# EAGLE design MINI_SAM_2017-01-015 (EAGLE 7.6.0)
BUILD: 2017/01; DESIGNER: BENJAMIN SHOCKLEY; REV: 015
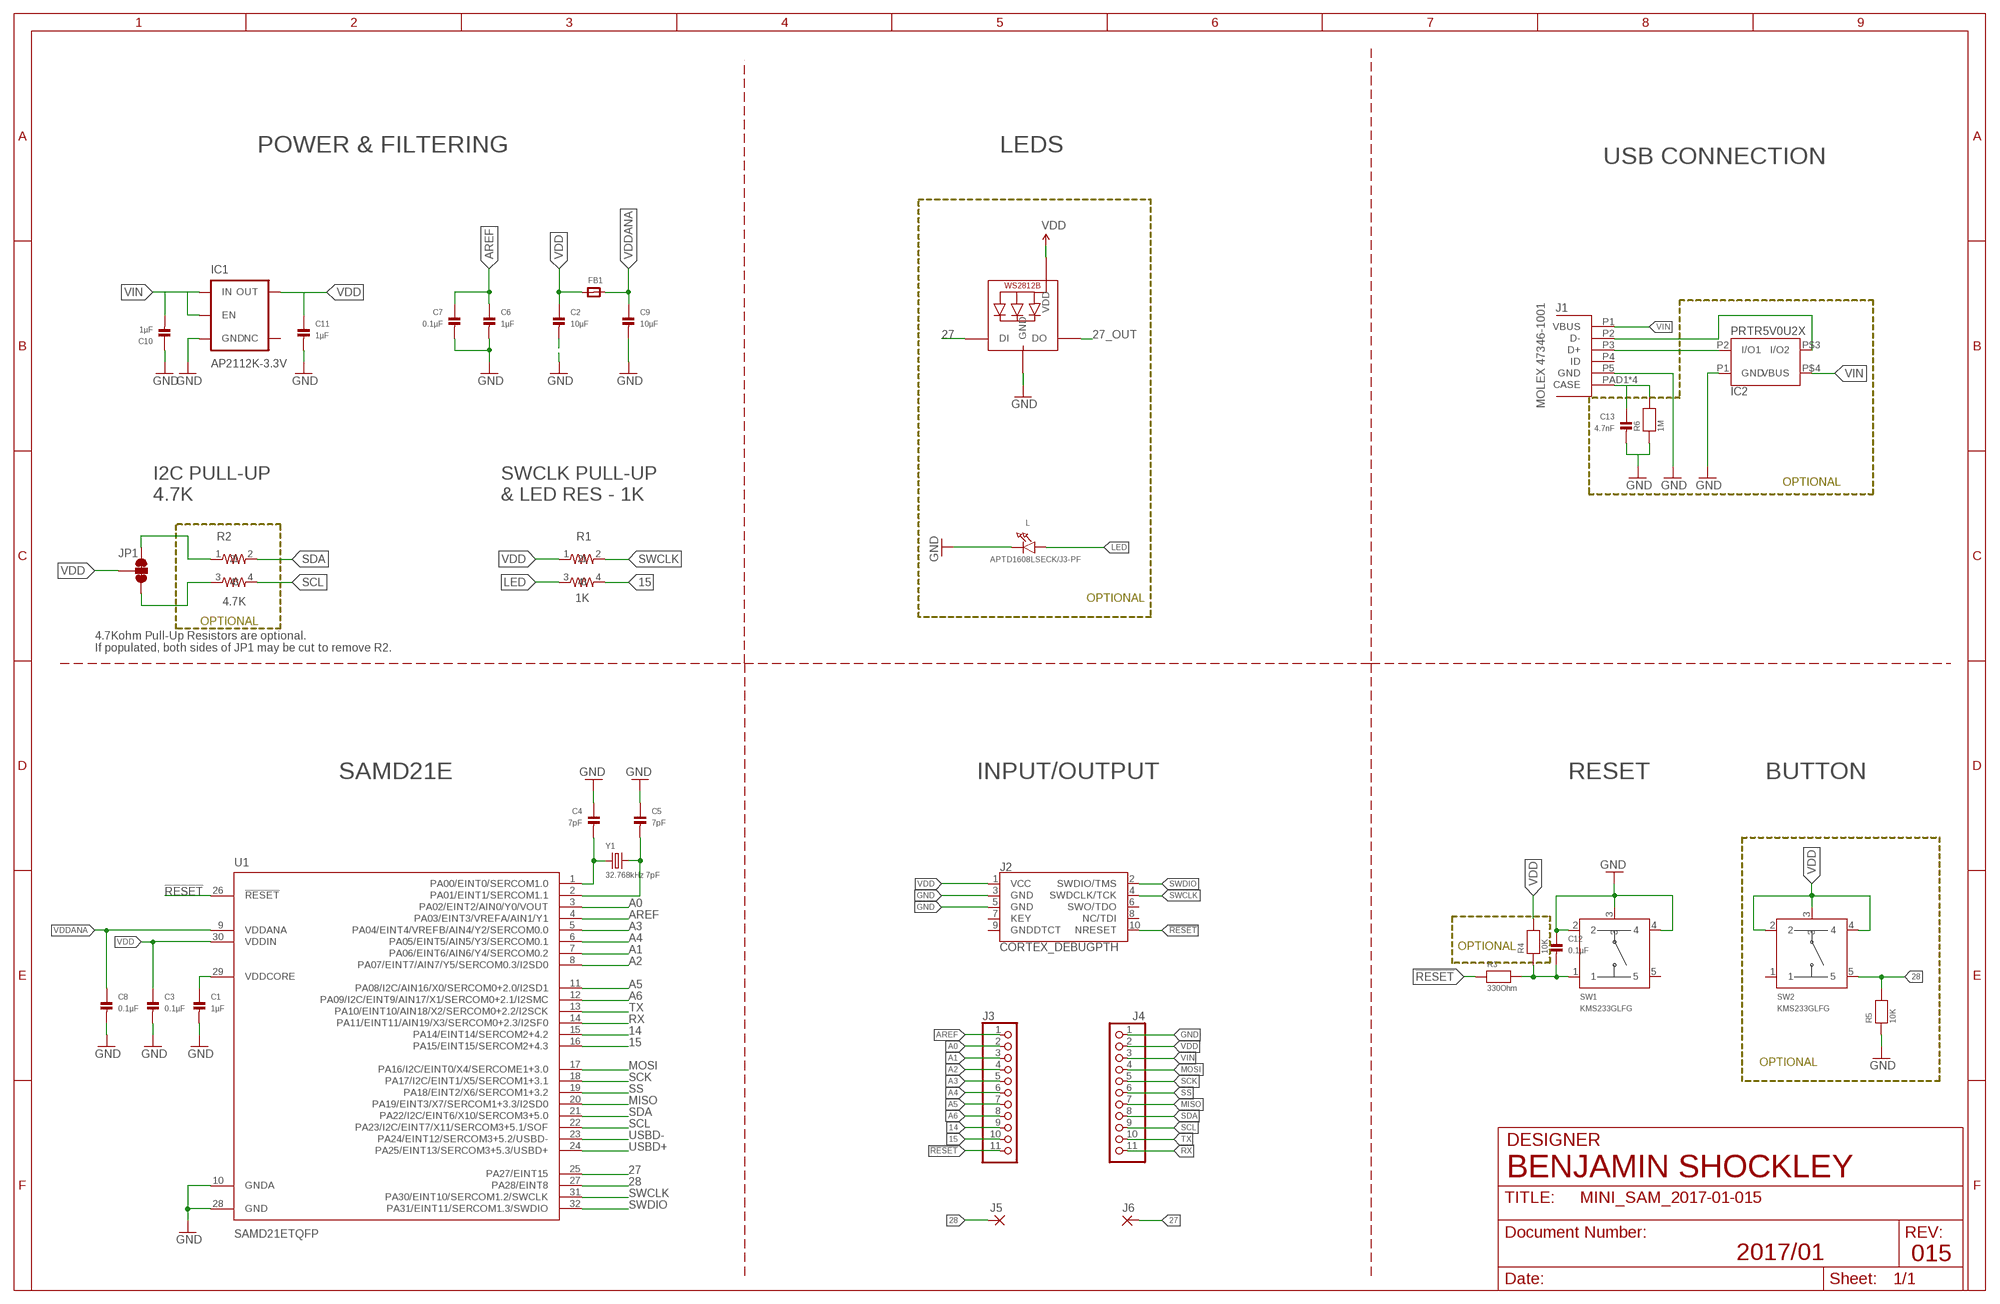
[diagram p0: schematic, sheet 1]

## Parts
C1  1µF  CAP_CERAMIC_0805MP  [_0805MP]
C2  10µF  CAP_CERAMIC_0805MP  [_0805MP]
C3  0.1µF  CAP_CERAMIC_0805MP  [_0805MP]
C4  7pF  CAP_CERAMIC_0805MP  [_0805MP]
C5  7pF  CAP_CERAMIC_0805MP  [_0805MP]
C6  1µF  CAP_CERAMIC_0805MP  [_0805MP]
C7  0.1µF  CAP_CERAMIC_0805MP  [_0805MP]
C8  0.1µF  CAP_CERAMIC_0805MP  [_0805MP]
C9  10µF  CAP_CERAMIC_0805MP  [_0805MP]
C10  1µF  CAP_CERAMIC_0805MP  [_0805MP]
C11  1µF  CAP_CERAMIC_0805MP  [_0805MP]
C12  0.1µF  CAP_CERAMIC_0805MP  [_0805MP]
C13  4.7nF  CAP_CERAMIC_0805MP  [_0805MP]
FB1  FERRITE_0805MP  [_0805MP]
IC1  AP2112K-3.3V  V_REG_AP2112K-3.3V  [SOT23-5]
IC2  PRTR5V0U2X  [SOT143B_REFLOW]
J1  MOLEX_47346-100147346  [MOLEX_47346-1001]
J2  CORTEX_DEBUGPTH  [2X5-PTH-1.27MM]
J3  PINHD-1X111X11_SMT  [1X11_SMT]
J4  PINHD-1X111X11_SMT  [1X11_SMT]
J5  FR11_PAD2MMX1MM  [SMD2MMX1MM]
J6  FR11_PAD2MMX1MM  [SMD2MMX1MM]
JP1  JUMPER-SMT_3_2-NC_TRACE_NO-SILK  [SMT-JUMPER_3_2-NC_TRACE_NO-SILK]
L  APTD1608LSECK/J3-PF  LED0603_NOOUTLINE  [CHIPLED_0603_NOOUTLINE]
R1  1K  RESISTOR_ARRAY_2  [RESISTOR_ARRAY_0606]
R2  4.7K  RESISTOR_ARRAY_2  [RESISTOR_ARRAY_0606]
R3  330Ohm  RESISTOR_0805MP  [_0805MP]
R4  10K  RESISTOR_0805MP  [_0805MP]
R5  10K  RESISTOR_0805MP  [_0805MP]
R6  1M  RESISTOR_0805MP  [_0805MP]
STATUS  WS2812B3535  [LED3535]
SW1  KMS233GLFG  KMS_SWITCHKMS  [KMS_SWITCH]
SW2  KMS233GLFG  KMS_SWITCHKMS  [KMS_SWITCH]
U1  SAMD21ETQFP  [TQFP32-08]
Y1  32.768kHz 7pF  CRYSTAL0805PACKAGE  [_0805MP]

## Nets
14: J3.9 U1.15(PA14/EINT14/SERCOM2+4.2)
15: J3.10 R1.4 U1.16(PA15/EINT15/SERCOM2+4.3)
27: J6.P$1(P) STATUS.1(DI) U1.25(PA27/EINT15)
27_OUT: STATUS.3(DO)
28: J5.P$1(P) R5.2 SW2.5 U1.27(PA28/EINT8)
!RESET: J2.10(NRESET) J3.11 R3.1 U1.26(!RESET)
A0: J3.2 U1.3(PA02/EINT2/AIN0/Y0/VOUT)
A1: J3.3 U1.7(PA06/EINT6/AIN6/Y4/SERCOM0.2)
A2: J3.4 U1.8(PA07/EINT7/AIN7/Y5/SERCOM0.3/I2SD0)
A3: J3.5 U1.5(PA04/EINT4/VREFB/AIN4/Y2/SERCOM0.0)
A4: J3.6 U1.6(PA05/EINT5/AIN5/Y3/SERCOM0.1)
A5: J3.7 U1.11(PA08/I2C/AIN16/X0/SERCOM0+2.0/I2SD1)
A6: J3.8 U1.12(PA09/I2C/EINT9/AIN17/X1/SERCOM0+2.1/I2SMC)
AREF: C6.1 C7.1 J3.1 U1.4(PA03/EINT3/VREFA/AIN1/Y1)
GND: C1.2 C2.2 C3.2 C4.1 C5.1 C6.2 C7.2 C8.2 C9.2 C10.1 C11.2 C12.1 C13.2 IC1.2(GND) IC2.P1(GND) J1.P5(GND) J2.3(GND) J2.5(GND) J4.1 L.C R5.1 R6.1 STATUS.4(GND) SW1.2 SW1.3 SW1.4 U1.10(GNDA) U1.28(GND)
LED: L.A R1.3
MISO: J4.7 U1.20(PA19/EINT3/X7/SERCOM1+3.3/I2SD0)
MOSI: J4.4 U1.17(PA16/I2C/EINT0/X4/SERCOME1+3.0)
N$1: C4.2 U1.1(PA00/EINT0/SERCOM1.0) Y1.1
N$2: C13.1 J1.PAD1(CASE) J1.PAD2(CASE) J1.PAD3(CASE) J1.PAD4(CASE) R6.2
N$3: JP1.1 R2.1
N$4: C12.2 R3.2 R4.1 SW1.1
N$5: C5.2 U1.2(PA01/EINT1/SERCOM1.1) Y1.2
N$6: JP1.3 R2.3
N$9: C1.1 U1.29(VDDCORE)
RX: J4.11 U1.14(PA11/EINT11/AIN19/X3/SERCOM0+2.3/I2SF0)
SCK: J4.5 U1.18(PA17/I2C/EINT1/X5/SERCOM1+3.1)
SCL: J4.9 R2.4 U1.22(PA23/I2C/EINT7/X11/SERCOM3+5.1/SOF)
SDA: J4.8 R2.2 U1.21(PA22/I2C/EINT6/X10/SERCOM3+5.0)
SS: J4.6 U1.19(PA18/EINT2/X6/SERCOM1+3.2)
SWCLK: J2.4(SWDCLK/TCK) R1.2 U1.31(PA30/EINT10/SERCOM1.2/SWCLK)
SWDIO: J2.2(SWDIO/TMS) U1.32(PA31/EINT11/SERCOM1.3/SWDIO)
TX: J4.10 U1.13(PA10/EINT10/AIN18/X2/SERCOM0+2.2/I2SCK)
USBD+ [USB_DATA]: IC2.P2(I/O1) J1.P3(D+) U1.24(PA25/EINT13/SERCOM3+5.3/USBD+)
USBD- [USB_DATA]: IC2.P$3(I/O2) J1.P2(D-) U1.23(PA24/EINT12/SERCOM3+5.2/USBD-)
VDD: C2.1 C3.1 C11.1 FB1.1 IC1.5(OUT) J2.1(VCC) J4.2 JP1.2 R1.1 R4.2 STATUS.2(VDD) SW2.2 SW2.3 SW2.4 U1.30(VDDIN)
VDDANA: C8.1 C9.1 FB1.2 U1.9(VDDANA)
VIN: C10.2 IC1.1(IN) IC1.3(EN) IC2.P$4(VBUS) J1.P1(VBUS) J4.3
Unconnected: IC1.4(NC) J1.P4(ID) J2.6(SWO/TDO) J2.7(KEY) J2.8(NC/TDI) J2.9(GNDDTCT) SW1.5 SW2.1

## Notes on the sheet
- POWER & FILTERING | LEDS
- USB CONNECTION
- MOLEX 47346-1001
- OPTIONAL
- I2C PULL-UP
  4.7K
- SWCLK PULL-UP
  & LED RES - 1K
- OPTIONAL
- OPTIONAL
- 4.7Kohm Pull-Up Resistors are optional.
  If populated, both sides of JP1 may be cut to remove R2.
- SAMD21E | INPUT/OUTPUT | RESET | BUTTON
- OPTIONAL
- OPTIONAL
- DESIGNER

## Library data of the parts
C1-C13 = microbuilder:CAP_CERAMIC: Ceramic Capacitors 0402 - 0402 Surface Mount Capacitors 16pF 50V 5% [Digikey: 445-4899-2-ND] 18pF 50V 5% [Digikey: 490-1281-2-ND] 22pF 50V 5% [Digikey: 490-1283-2-ND] 68pF 50V 5% [Digikey: 490-1289-2-ND] 0.1uF 10V 10% [Digikey: 490-1318-2-ND] 1.0uF 6.3V 10% [Digikey: 490-1320-2-ND] 0603 - 0603 Surface Mount Capacitors 16 pF 50V 5% [Digikey: 445-5051-2-ND] 22 pF 50V [Digikey: PCC220ACVTR-ND] 33 pF 50V 5% [Digikey: 490-1415-1-ND] 56pF 50V 5% [Digikey: 490-1421-1-ND] 220pF 50V 5% [Digikey: 445-1285-1-ND] 680 pF 50V 2200 pF 50V 5% C0G [Digikey: 445-1297-1-ND] 5600 pF 100V 5% X7R [Digikey: 478-3711-1-ND] 0.1 µF 25V 10% [Digikey: PCC2277TR-ND] 0.22 µF 16V 10% X7R [Digikey: 445-1318-1-ND] 1.0 µF 25V 10% [Digikey: 445-5146-2-ND] 0603 - RF Specific 3pF 250V +/-0.1pF RF [Digikey: 712-1347-1-ND] 18 pF 250V 5% [Digikey: 478-3505-1-ND or 712-1322-1-ND] 56 pF 250V 5% C0G RF [Digikey: 490-4867-1-ND] 68 pF 250V RF [Digikey: 490-4868-1-ND] 0805 - 0805 Surface Mount Capacitors 220 pF 250V 2% RF Ceramic Capacitor [Digikey: 712-1398-1-ND] 1000 pF 50V 2% NP0 Ceramic Capacitor [Digikey: 478-3760-1-ND] 0.1 µF 25V 10% Ceramic Capacitor [Digikey: PCC1828TR-ND] 1.0 µF 16V 10% Ceramic Capacitor[Digikey: 490-1691-2-ND] 10.0 µF 10V 10% Ceramic Capacitor[Digikey: 709-1228-1-ND] 10.0 uF 16V 10% Ceramic Capacitor [Digikey: 478-5165-2-ND] 47 uF 6.3V 20% Ceramic Capacitor [Digikey: 587-1779-1-ND or 399-5506-1-ND] 1206 - 1206 Surface Mount Capacitors 47uF 10V 20% Ceramic Capacitor [Digikey: 490-5528-1-ND or 399-5508-1-ND or 445-6010-1-ND] 100uF 6.3V -20%, +80% Y5V Ceramic Capacitor (Digikey: 490-4512-1-ND, Mouser: 81-GRM31CF50J107ZE1L)
FB1 = microbuilder:FERRITE: Ferrite Bead 0603 MMZ1608B121C - 120 Ohm @ 100MHz, 600mA, 0.15 Ohm DC Resistance - Digikey: 445-2164-1-ND BK1608HW121-T - 120 Ohm, 600mA Ferrite Chip - Digikey: 587-1876-2-ND 0805 HZ0805B272R-10 - 2.7K Ohm @ 100MHz, 200mA, 0.8 Ohm DC Resistance - Digikey: 240-2504-1-ND (see also Murata BLM21BD272SN1L) MMZ2012Y152B - 1.5K Ohm @ 100MHz, 500mA, 0.4 Ohm DC Resistance - Digikey: 445-1560-1-ND - Mainly for high frequency (80-400MHz) MMZ2012R102A - 1K Ohm @ 100MHz, 500mA, 0.3 Ohm DC Resistance - Digikey: 445-1555-2-ND - More general purpose (10-200MHz)
IC1 = SparkFun-PowerIC:V_REG_AP2112: AP2112 - 600mA CMOS LDO Regulator w/ Enable The AP2112 is CMOS process low dropout linear regulator with enable function, the regulator delivers a guaranteed 600mA (min.) continuous load current. Features Output Voltage Accuracy: ±1.5% Output Current: 600mA (Min.) Foldback Short Current Protection: 50mA Enable Function to Turn ON/OFF VOUT Low Dropout Voltage (3.3V): 250mV (Typ.) @IOUT=600mA Excellent Load Regulation: 0.2%/A (Typ.) Excellent Line Regulation: 0.02%/V (Typ.) Low Quiescent Current: 55μA (Typ.) Low Standby Current: 0.01μA (Typ.) Low Output Noise: 50μVRMS PSRR: 100Hz -65dB, 1kHz -65dB OTSD Protection Stable with 1.0μF Flexible Cap: Ceramic, Tantalum and Aluminum Electrolytic Operation Temperature Range: -40°C to 85°C ESD: MM 400V, HBM 4000V; PROD_ID: VREG-12457; VALUE: 3.3V
IC2 = Shockley_Custom:PRTR5V0U2X
J1 = Shockley_Custom:MOLEX_47346-1001
J2 = SparkFun-Connectors:CORTEX_DEBUG: Cortex Debug Connector Datasheet <http://infocenter.arm.com/help/topic/com.arm.doc.faqs/attached/13634/cortex_debug_connectors.pdf>
J3 J4 = pinhead+:PINHD-1X11: PIN HEADER
J5 J6 = Shockley_Custom:FR11_PAD
JP1 = SparkFun-Jumpers:JUMPER-SMT_3_2-NC_TRACE: Normally closed trace jumper (2 of 2 connections) This jumper has a trace between all three pads so they are normally closed (NC). Use a razor knife to open the connection(s). For best results follow the IPC guidelines for cutting traces: Cutout at least 0.063 mm (0.005 in). Remove all loose material to clean up the cut area. Seal the cut with an approved epoxy. Reapply solder to reclose the connection(s).
L = microbuilder:LED: LED 0603 - 0603 Surface Mount Package 2mA: Green LED - Low Power (3.9mcd, 2ma, 1.7Vf) - Digikey: 475-2709-2-ND Orange LED - Low Power (9.8mcd, 2ma, 1.8Vf) - Digikey: 475-1194-2-ND Red LED - Low Power (5mcd, 2ma, 1.8Vf) - Digikey: 475-1195-2-ND Yellow LED - Low Power (7mcd, 2ma, 1.8Vf) - Digikey: 475-1196-2-ND 5mA: Blue LED - Low Power (17mcd, 5ma, 2.9Vf) - Digikey: LNJ937W8CRACT-ND 0805 - 0805 Surface Mount Package 2mA: Red LED (8.8mcd, 2mA, 1.8Vf, Clear) - Low Power [Digikey: 475-2510-1-ND] Green LED (5mcd, 2mA, 1.8Vf, Clear) - Low Power [Digikey: 475-2730-1-ND] Yellow LED (11.3mcd, 2mA, 1.8Vf, Clear) - Low Power [Digikey: 475-2555-1-ND] 20mA: Red LED (104mcd, 20mA, Diffused) - LS R976 [Digikey: 475-1278-6-ND] Red LED (12mcd, 20mA, 2.0Vf, Clear) - APT2012EC [Digikey: 754-1128-1-ND] Green LED (15mcd, 20mA, 2.2Vf, Clear) - APT2012GC [Digikey: 754-1131-1-ND] Orange LED (160mcd, 20mA, 2.1Vf, Clear) - APT2012SECK [Digikey: 754-1130-1-ND] 1206 - 1206 Surface Mount Package Green LED (26mcd, 20mA, Diffused) - LG N971 [Digikey: 475-1407-6-ND] Red LED (15mcd, 20mA, Diffused) - LH N974 [Digikey: 475-1416-6-ND]
R1 R2 = Shockley_Custom:RESISTOR_ARRAY_2
R3-R6 = microbuilder:RESISTOR: Resistors 0402 - 0402 Surface Mount Package 22 Ohm 1% 1/16W [Digikey: 311-22.0LRTR-ND] 33 Ohm 5% 1/16W 1.0K 5% 1/16W 1.5K 5% 1/16W 2.0K 1% 1/16W 10.0K 1% 1/16W [Digikey: 311-10.0KLRTR-ND] 10.0K 5% 1/16W [Digikey: RMCF0402JT10K0TR-ND] 12.1K 1% 1/16W [Digikey: 311-22.0LRTR-ND] 100.0K 5% 1/16W 0603 - 0603 Surface Mount Package 0 Ohm 1/10 Watt 1% Resistor 15 Ohm 1/10 Watt 1% Resistor 33 Ohm 1/10 Watt 1% Resistor 49.9 Ohm 1/10 Watt 1% Resistor 100 Ohm 1/10 Watt 1% Resistor 150 Ohm 1/10 Watt 1% Resistor 240 Ohm 1/10 Watt 1% Resistor 390 Ohm 1/10 Watt 1% Resistor 560 Ohm 1/10 Watt 1% Resistor 680 Ohm 1/10 Watt 1% Resistor 750 Ohm 1/10 Watt 1% Resistor 1.0K Ohm 1/10 Watt 1% Resistor 1.5K Ohm 1/10 Watt 1% Resistor 2.0K Ohm 1/10 Watt 1% Resistor 2.2K Ohm 1/10 Watt 1% Resistor 3.3K Ohm 1/10 Watt 1% Resistor 4.7K Ohm 1/10 Watt 1% Resistor 10.0K Ohm 1/10 Watt 1% Resistor 12.0K Ohm 1/10 Watt 1% Resistor 12.1K Ohm 1/10 Watt 1% Resistor 20.0K Ohm 1/10 Watt 1% Resistor 33.0K Ohm 1/10 Watt 1% Resistor 100.0K Ohm 1/10 Watt 1% Resistor 0805 - 0805 Surface Mount Package 0 Ohm 1/8 Watt 1% Resistor 33 Ohm 1/8 Watt 1% Resistor 100 Ohm 1/8 Watt 1% Resistor 150 Ohm 1/8 Watt 1% Resistor 200 Ohm 1/8 Watt 1% Resistor 240 Ohm 1/8 Watt 1% Resistor 330 Ohm 1/8 Watt 1% Resistor 390 Ohm 1/8 Watt 1% Resistor 470 Ohm 1/8 Watt 1% Resistor 1.0K Ohm 1/8 Watt 1% Resistor 1.5K Ohm 1/8 Watt 1% Resistor 2.0K Ohm 1/8 Watt 1% Resistor 4.7K Ohm 1/8 Watt 1% Resistor 5.1K Ohm 1/8 Watt 1% Resistor 5.6K Ohm 1/8 Watt 1% Resistor 10.0K Ohm 1/8 Watt 1% Resistor 22.0K Ohm 1/8 Watt 1% Resistor 33.0K Ohm 1/8 Watt 1% Resistor 100K Ohm 1/8 Watt 1% Resistor 1206 - 1206 Surface Mount Package 2012 - 2010 Surface Mount Package 0.11 Ohm 1/2 Watt 1% Resistor - Digikey: RHM.11UCT-ND
STATUS = adafruit:WS2812B
SW1 SW2 = Shockley_Custom:KMS_SWITCH
U1 = Shockley_Custom:SAMD21E
Y1 = Shockley_Custom:CRYSTAL: Crystals HC49UP - Surface Mount Crystal 4.0MHz 18pF +/-30ppm Surface Mount Crystal [Digikey: 535-9857-1-ND] 12.0 MHz Surface Mount Crystal [Digikey: 535-9869-6-ND] 25.0 MHz Surface Mount Crystal [Digikey: 535-9078-1-ND] 2.5 x 2.0mm - MEMs SMT Crystal 16.0 MHz 10pF 20ppm 2.5 x 2.0mm Crystal [Digikey -40-85°C: 535-10923-1-ND] 3.2 x 2.5mm - MEMs SMT Crystal 12.0 MHz 8pF 15ppm 3.2 x 2.5mm Crystal [Digikey: -10-70°C: 644-1047-1-ND -40-125°C: 644-1128-1-ND] 16.0 MHz 8pF 15ppm 3.2 x 2.5mm Crystal [Digikey: -10-70°C: 644-1049-1-ND -40-125°C: 644-1129-2-ND] 16.0 MHz 10pF 10ppm 3.2 x 2.5mm Crystal [Digikey: 644-1100-1-ND] 27.12 MHz 18pF 30ppm 3.2 x 2.5mm Crystal [Digikey: 887-1424-1-ND] 27.12MHz 10pF 10ppm 3.2 x 2.5mm Crystal [Digikey: 887-1329-1-ND] 4.9 x 1.8mm - MEMs SMT Crystal 32.768 KHz 12.5pF 20ppm 4.9 x 1.8mm Crystal [Digikey: SE2415CT-ND] 8.0 x 3.8mm - Surface Mount Crystal 32.768kHz 12.5pF 20ppm -40°C-85°C [Digikey: 535-9166-2-ND] Cylinder 32.768KHz Cylinder Crystal (2x6mm body) [Ex. Digikey: 300-8341-2-ND]

## Board
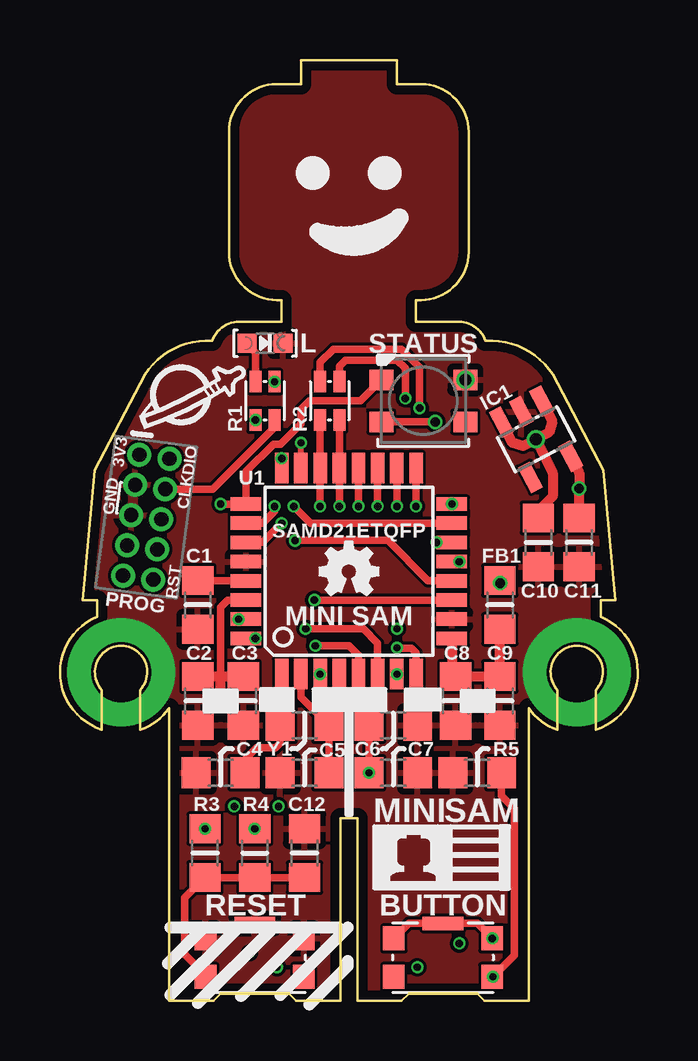
[diagram p1: board, top side]
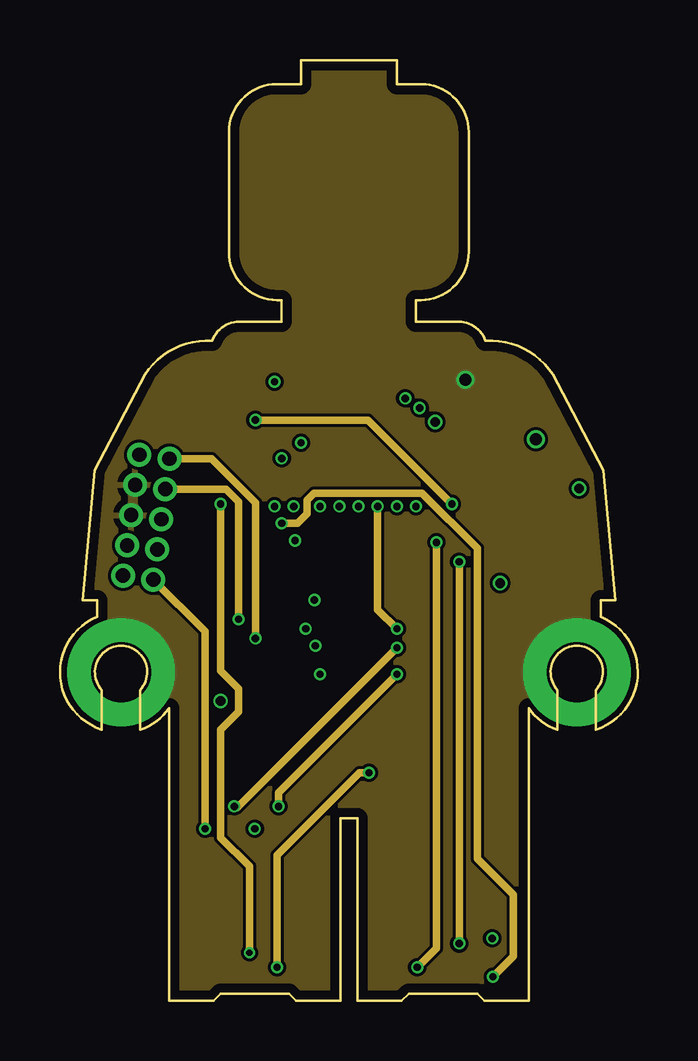
[diagram p2: board, inner layer Route2]
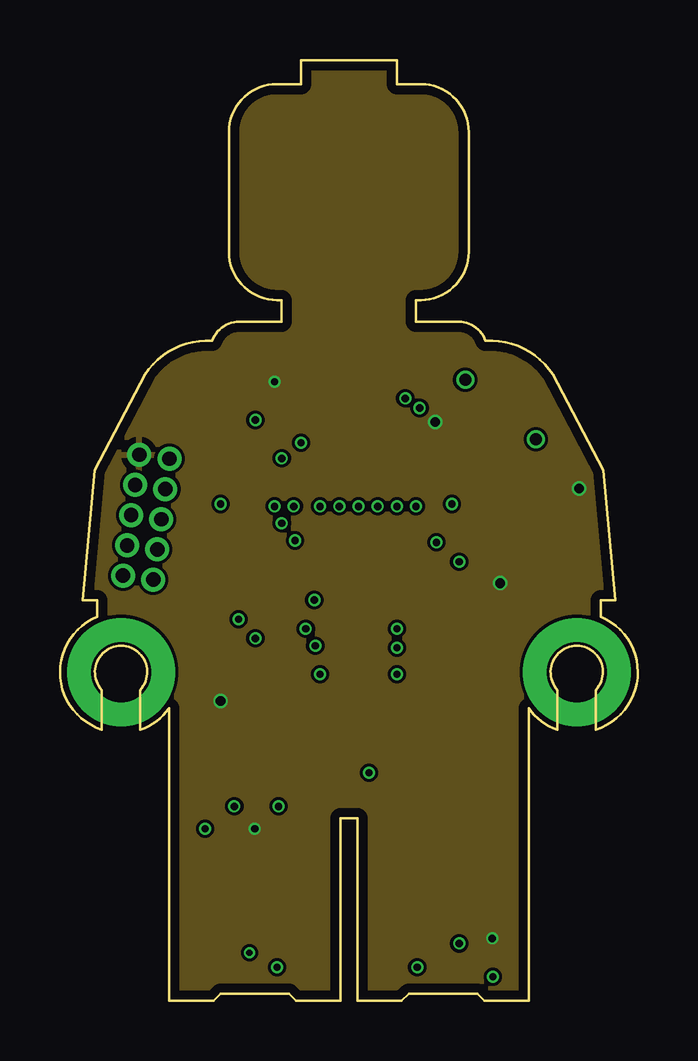
[diagram p3: board, inner layer Route15]
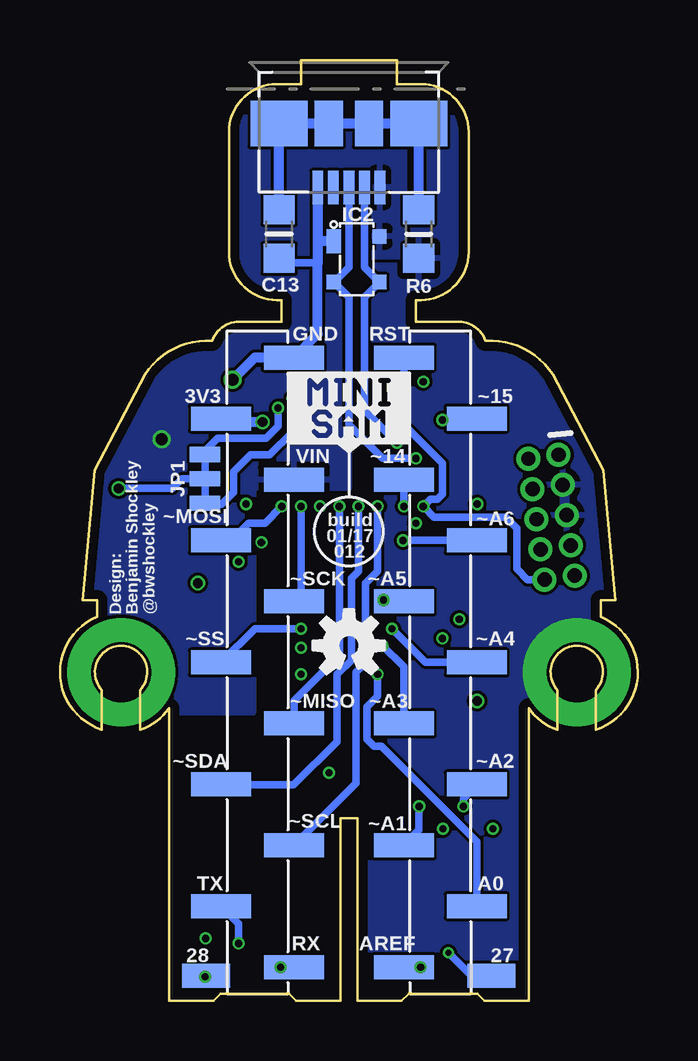
[diagram p4: board, bottom side, seen from below]

Size 24.1 x 39.2 mm. Coordinates in mm from the lower left corner, seen from the top.
Outline: 10.05,39.2 14.05,39.2 14.05,38.2 15.05,38.2 arc-90 17.05,36.2 17.05,31.2 arc-90 15.05,29.2 14.85,29.2 14.85,28.3 16.73,28.3 arc-63 17.75,27.5 arc-60 20.55,26.1 22.65,22.1 23.15,16.7 22.55,16.7 22.55,16 arc-140 22.35,11.3 22.35,12.95 arc132 21.55,14.8 arc132 20.75,12.95 20.75,11.3 arc-40 19.55,12.2 19.55,0 17.7,0 17.4,0.3 14.55,0.3 14.25,0 12.4,0 12.4,7.6 11.7,7.6 11.7,0 9.85,0 9.55,0.3 6.7,0.3 6.4,0 4.55,0 4.55,12.2 arc-40 3.35,11.3 3.35,12.95 arc132 2.55,14.8 arc132 1.75,12.95 1.75,11.3 arc-140 1.55,16 1.55,16.7 0.95,16.7 1.45,22.1 3.55,26.1 arc-60 6.35,27.5 arc-63 7.37,28.3 9.25,28.3 9.25,29.2 9.05,29.2 arc-90 7.05,31.2 7.05,36.2 arc-90 9.05,38.2 10.05,38.2 10.05,39.2
Copper layers (1*2*15*16): Top 0.035559375mm / dielectric 0.17018125mm / Route2 0.01778125mm / dielectric 47mil / Route15 0.01778125mm / dielectric 0.17018125mm / Bottom 0.035559375mm
Design rules "OSHPark-4layer *": minimum track width 5mil, minimum drill 10mil, track to track 5mil, track to pad 5mil, pad to pad 5mil, via to via 5mil, smd to smd 5mil, copper to edge 15mil, drill to drill 6mil, minimum pad ring 4mil, minimum via ring 4mil, stop-mask expansion 2.5mil, vias tented up to drill 28mil, thermal gap 10mil

### Footprints (pad centres in the part's own frame; a part is rotated, then mirrored left to right if it is on the bottom)
_0805MP = smd 1.2 x 1.3: 1 -1.016,0; 2 1.016,0
SOT23-5 = smd 0.55 x 1.2: 1 -0.95,-1.3; 2 0,-1.3; 3 0.95,-1.3; 4 0.95,1.3; 5 -0.95,1.3
SOT143B_REFLOW = smd 1 x 0.6: P1 -0.75,-0.95 | smd 0.6 x 0.6: P2 0.95,-0.95; P$3 0.95,0.95; P$4 -0.95,0.95
MOLEX_47346-1001 = smd 0.45 x 1.38: P1 1.3,-2.66; P2 0.65,-2.66; P3 0,-2.66; P4 -0.65,-2.66; P5 -1.3,-2.66 | smd 2.375 x 1.9: PAD1 -2.913,0; PAD4 2.913,0 | smd 1.175 x 1.9: PAD2 -0.838,0; PAD3 0.838,0
2X5-PTH-1.27MM = drill 0.6 pad 1: 1 -2.54,-0.635; 2 -2.54,0.635; 3 -1.27,-0.635; 4 -1.27,0.635; 5 0,-0.635; 6 0,0.635; 7 1.27,-0.635; 8 1.27,0.635; 9 2.54,-0.635; 10 2.54,0.635
1X11_SMT = smd 1 x 2.5: 1 -12.7,1.52; 2 -10.16,-1.52; 3 -7.62,1.52; 4 -5.08,-1.52; 5 -2.54,1.52; 6 0,-1.52; 7 2.54,1.52; 8 5.08,-1.52; 9 7.62,1.52; 10 10.16,-1.52; 11 12.7,1.52
SMD2MMX1MM = smd 1 x 2: P$1 0,0
SMT-JUMPER_3_2-NC_TRACE_NO-SILK = smd 0.635 x 1.27: 1 -1.016,0; 2 0,0; 3 1.016,0
CHIPLED_0603_NOOUTLINE = smd 0.8 x 0.8: A 0,-0.75; C 0,0.75
RESISTOR_ARRAY_0606 = smd 0.5 x 0.9: 1 -0.4,-0.8; 2 -0.4,0.8; 3 0.4,-0.8; 4 0.4,0.8
LED3535 = smd 1 x 0.85: 1 -1.75,0.875; 2 -1.75,-0.875; 3 1.75,-0.875; 4 1.75,0.875
KMS_SWITCH = smd 0.9 x 1: 1 -2.05,-0.8; 2 -2.05,0.8; 4 2.05,0.8; 5 2.05,-0.8 | smd 1.7 x 0.55: 3 0,1.425
TQFP32-08 = smd 1.27 x 0.559: 1 -4.293,2.8; 2 -4.293,2; 3 -4.293,1.2; 4 -4.293,0.4; 5 -4.293,-0.4; 6 -4.293,-1.2; 7 -4.293,-2; 8 -4.293,-2.8; 17 4.293,-2.8; 18 4.293,-2; 19 4.293,-1.2; 20 4.293,-0.4; 21 4.293,0.4; 22 4.293,1.2; 23 4.293,2; 24 4.293,2.8 | smd 0.559 x 1.27: 9 -2.8,-4.293; 10 -2,-4.293; 11 -1.2,-4.293; 12 -0.4,-4.293; 13 0.4,-4.293; 14 1.2,-4.293; 15 2,-4.293; 16 2.8,-4.293; 25 2.8,4.293; 26 2,4.293; 27 1.2,4.293; 28 0.4,4.293; 29 -0.4,4.293; 30 -1.2,4.293; 31 -2,4.293; 32 -2.8,4.293

### Placement (x,y rotation side)
C1  5.75,16.5 270 top
C2  5.75,12.5 270 top
C3  7.65,12.5 270 top
C4  6.7,9.5 0 top
C5  10.2,9.5 0 top
C6  13.9,11.48 0 top
C7  13.9,9.5 0 top
C8  16.5,12.5 270 top
C9  18.35,12.5 270 top
C10  19.95,19.1 90 top
C11  21.65,19.1 270 top
C12  10.2,6.15 270 top
C13  14.96,31.95 270 bottom
FB1  18.35,16.5 270 top
IC1  19.85,23.4 207.7 top
IC2  11.72,30.9 270 bottom
J1  12.05,36.55 0 bottom
J2  3.6,20.15 262.4 top
J3  8.24,14.1 90 bottom
J4  15.86,14.1 270 bottom
J5  18,1.05 90 bottom
J6  6.1,1.05 270 bottom
JP1  18.05,21.75 270 bottom
L  8.55,27.4 270 top
R1  8.55,25 180 top
R2  11.25,25 180 top
R3  6.05,6.15 270 top
R4  8.12,6.15 90 top
R5  17.4,9.5 0 top
R6  9.14,31.95 90 bottom
STATUS  15.15,25 0 top
SW1  8.12,1.8 0 top
SW2  15.97,1.8 0 top
U1  12.05,17.9 90 top
U$1  [OSHW-LOGO-MINI]  12.05,17.9 0 top
U$3  [OSHW-LOGO-S]  12.05,14.8 0 bottom
Y1  10.2,11.48 0 top

### Tracks (layer width: path | path; a pad name or v marks a point on that pad's centre or on a via)
14  (via drill 0.3)
  Top 0.305: U1.15 10.45,19.9 v9.75,20.6
  Bottom 0.254: J3.9
  Bottom 0.305: v9.75,20.6 J3.9
15  (via drill 0.3)
  Route2 0.305: R1.4 12.84,24.2 U1.16
  Bottom 0.305: R1.4 6.72,24.2 J3.10
  other vias: 16.34,20.7 8.15,24.2
27  (via drill 0.25, 0.3)
  Top 0.305: STATUS.1 12.52,25 10.4,25 10.05,24.65 10.05,24.05 9.2,23.2 8.9,23.2 7.75,22.06 U1.25 v6.7,20.7
  Route2 0.305: v6.7,20.7 6.7,13.75 7.45,13 7.45,12.05 6.7,11.3 6.7,6.8 7.9,5.6 v7.9,2
  Bottom 0.305: J6.P$1 6.95,1.05 v7.9,2
28  (via drill 0.3)
  Top 0.254: v18.05,1 SW2.5
  Top 0.305: U1.27 8.45,19.1 v9.25,19.9 | R5.2 18.41,8.53 18.95,8 18.95,1.9 v18.05,1
  Route2 0.305: v18.05,1 18.9,1.85 18.9,4.42 17.4,5.92 17.4,18.85 15.1,21.15 10.6,21.15 10.3,20.85 10.3,20.3 9.9,19.9 v9.25,19.9
  Bottom 0.254: J5.P$1 v18.05,1
!RESET  (via drill 0.3)
  Top 0.254: U1.26 8.25,19.9
  Top 0.305: 8.25,19.9 8.45,19.9 8.95,20.4 v8.95,20.6
  Route2 0.305: J2.10 6.05,15.39 R3.1
  Bottom 0.305: J3.11 9.76,24.01 8.15,22.4 8.15,21.1 8.35,20.9 8.65,20.9 v8.95,20.6 8.5,20.15 5.5,20.15 5.05,19.7 5.05,18 4.6,17.55 J2.10
  other vias: 6.05,7.17
A0  (via drill 0.3)
  Bottom 0.305: U1.3 10.85,12.7 11.3,12.25 11.3,10.9 11,10.6 10.7,10.6 6.72,6.62 J3.2
  other vias: 10.85,13.61
A1  (via drill 0.3)
  Route2 0.254: U1.7
  Route2 0.305: v9.12,8.1 9.12,8.68 U1.7
  Bottom 0.305: v9.12,8.1 9.12,7.12 J3.3
  other vias: 14.05,13.61
A2  (via drill 0.3)
  Top 0.254: v14.05,14.7 v14.05,14.71
  Top 0.305: U1.8 14.85,14.5 14.65,14.7 v14.05,14.7
  Route2 0.305: v7.27,8.1 7.39,8.05 v14.05,14.71
  Bottom 0.304: v7.27,8.1 7.27,8.42 J3.4
A3  (via drill 0.3)
  Top 0.305: v10.65,14.8 12.05,14.8 12.45,14.4 U1.5
  Bottom 0.305: v10.65,14.8 9.76,13.91 J3.5
A4  (via drill 0.3)
  Top 0.305: v10.25,15.5 12.65,15.5 13.25,14.9 U1.6
  Bottom 0.305: v10.25,15.5 8.85,14.1 J3.6
A5  (via drill 0.3)
  Top 0.305: U1.11 v10.61,16.7
  Bottom 0.305: J3.7 9.81,16.69 v10.61,16.7
A6  (via drill 0.3)
  Top 0.305: U1.12 15.35,17.5 13.67,19.18 v9.8,19.18
  Bottom 0.305: v9.8,19.18 J3.8
AREF  (via drill 0.3)
  Top 0.305: U1.4 11.65,13 12.88,11.77 C6.1 C7.1
  Route2 0.305: v9.06,1.4 9.06,6.06 12.5,9.5 C7.1
  Bottom 0.254: J3.1 v9.06,1.4
  other vias: 12.88,9.5
GND  (via drill 0.5, 2.5 pad 4.5)
  Bottom 0.305: 13.35,30.75 14.65,30.75 C13.2 | 9.14,30.73 R6.1
  Bottom 0.406: J1.P5 13.35,31.65 | 13.35,31.65 13.35,30.75 13.35,27.79 J4.1 15.97,26.8 STATUS.4 | IC2.P1 13.35,31.65
  other vias: 2.55,13.7 16.9,25.88 21.55,13.7
  pour Top: 4.55,0 19.55,0 19.55,12 21.05,12 21.05,14 22.05,14 22.05,12 24.05,12 24.05,40 0.05,40 0.05,12 2.05,12 2.05,14 3.05,14 3.05,12 4.55,12
  pour Route2: 4.55,0 19.55,0 19.55,12 21.05,12 21.05,14 22.05,14 22.05,12 24.05,12 24.05,40 0.05,40 0.05,12 2.05,12 2.05,14 3.05,14 3.05,12 4.55,12
  pour Bottom (rank 2): 9.75,40 9.75,31 12.05,31 12.05,21.35 16.05,21.35 16.05,12 19.55,12 19.55,0 4.55,0 4.55,12 3.05,12 3.05,14 2.05,14 2.05,12 0.05,12 0.05,40
LED
  Top 0.305: R1.3 8.15,27 L.A
MISO  (via drill 0.3)
  Top 0.305: U1.20 v12.45,20.6
  Bottom 0.305: J4.7 14.34,12.51 12.45,14.4 v12.45,20.6
MOSI  (via drill 0.3)
  Top 0.305: U1.17 v14.85,20.6
  Bottom 0.254: 16.47,19.18 16.95,19.18 J4.4
  Bottom 0.305: 16.95,19.18 arc90 16.63,19.5 16.23,19.9 15.55,19.9 v14.85,20.6
N$1
  Top 0.305: U1.1 9.25,11.55 Y1.1 9.18,10.73 9,10.55 8.2,10.55 7.76,10.12 C4.2
N$2
  Bottom 0.406: R6.2 J1.PAD4 J1.PAD3 J1.PAD2 J1.PAD1 C13.1
N$3  (via drill 0.3)
  Top 0.305: v14.4,25.1 14.4,26.35 14.05,26.7 11.9,26.7 11.65,26.45 R2.1
  Bottom 0.305: v14.4,25.1 14.4,23.7 15.35,22.75 16.15,22.75 16.85,22.05 16.85,21.2 17.35,20.7 18.05,20.7 18.05,21.75
N$4
  Top 0.254: 6.07,1.07 SW1.1
  Top 0.305: C12.2 R4.1 R3.2 5.2,4.28 5.2,1.95 6.07,1.07
N$5
  Top 0.305: U1.2 10.05,12.65 Y1.2 C5.2
N$6  (via drill 0.3)
  Top 0.305: R2.3 10.85,26.6 11.4,27.15 14.25,27.15 15,26.4 v15,24.7
  Bottom 0.305: v15,24.7 15,23.95 15.5,23.45 17.51,23.45 18.2,22.77 | 17.83,22.75 18.2,22.77 | 18.2,22.77 18.05,22.77
N$9
  Top 0.254: 5.81,17.5 C1.1
  Top 0.305: U1.29 5.81,17.5
RX  (via drill 0.3)
  Top 0.305: v15.7,19.1 U1.14
  Route2 0.305: v14.9,1.4 15.7,2.2 v15.7,19.1
  Bottom 0.254: J4.11 v14.9,1.4
SCK  (via drill 0.3)
  Top 0.305: U1.18 v14.05,20.6
  Bottom 0.254: 14.05,17.12 J4.5
  Bottom 0.305: v14.05,20.6 14.05,17.12
SCL  (via drill 0.3)
  Top 0.305: v10.85,20.6 U1.22 R2.4
  Bottom 0.305: v10.85,20.6 10.85,17.9 11.35,17.4 11.35,14.1 11.75,13.7 11.75,9.07 J4.9
SDA  (via drill 0.3)
  Top 0.305: v11.65,20.6 U1.21 R2.2
  Bottom 0.254: 16.97,9.02 J4.8 17.55,9
  Bottom 0.305: v11.65,20.6 11.65,17.9 11.95,17.6 11.95,14.2 12.55,13.6 12.55,10.8 14.35,9 17.55,9
SS  (via drill 0.3)
  Top 0.305: U1.19 v13.25,20.6
  Route2 0.305: v13.25,20.6 13.25,16.3 v14.05,15.5
  Bottom 0.305: J4.6 15.97,15.5 v14.05,15.5
SWCLK  (via drill 0.3)
  Top 0.254: U1.31 v7.45,15.9
  Top 0.305: J2.4 6.37,21.32 8.95,23.9 R1.2
  Route2 0.305: v7.45,15.9 7.45,20.8 6.92,21.32 J2.4
SWDIO  (via drill 0.3)
  Top 0.203: U1.32 v8.15,15.1
  Route2 0.305: v8.15,15.1 8.15,20.75 6.31,22.58 J2.2
TX  (via drill 0.3)
  Top 0.305: U1.13 v16.65,18.3
  Route2 0.305: v16.65,18.3 v16.65,2.39
  Bottom 0.305: v16.65,2.39 16.65,3.21 J4.10
USBD+  (via drill 0.3)
  Top 0.254: U1.24 v9.25,22.6
  Bottom 0.305: v9.25,22.6 10.65,22.6 12.05,24 12.05,29.32 IC2.P2 12.05,30.57 J1.P3
USBD-  (via drill 0.3)
  Top 0.254: U1.23 v10.05,23.25
  Bottom 0.305: v10.05,23.25 11.4,24.6 11.4,29.32 IC2.P$3 11.4,30.57 J1.P2
VDD  (via drill 0.3, 0.4)
  Top 0.254: v18.35,17.4 FB1.1 | C3.1 7.83,14 8.15,14
  Top 0.305: SW2.2 14.55,3.23 SW2.3 17.4,3.23 SW2.4 | 6.7,13.52 6.7,16.4 7,16.7 U1.30 | STATUS.2 v15.65,24.12
  Top 0.406: C2.1 6.7,13.52 | 6.7,13.52 C3.1 | v6.7,12.5 6.7,13.52 | C11.1 v21.65,21.35 21.65,22 IC1.5
  Bottom 0.305: 18.05,22.77 JP1.2 19,21.75 19.4,21.35 v21.65,21.35
  Bottom 0.406: J4.2 17.24,24.12 v15.65,24.12
  other vias: 8.12,7.17 18.02,2.6 8.95,25.8
  pour Route15: 4.55,0 19.55,0 19.55,12 21.05,12 21.05,14 22.05,14 22.05,12 24.05,12 24.05,40 0.05,40 0.05,12 2.05,12 2.05,14 3.05,14 3.05,12 4.55,12
VDDANA
  Top 0.406: FB1.2 C9.1 C8.1 16.34,13.67 U1.9
VIN  (via drill 0.5)
  Top 0.406: IC1.3 18.84,23.27 19.32,23.12 v19.85,23.4 | IC1.1 20.53,24.15 20.38,23.68 v19.85,23.4 | 19.95,20.5 C10.2 19.95,20.42 20.55,21.02 20.55,22 v19.85,23.4
  pour Bottom: 9.75,40 9.75,31 12.05,31 12.05,21.35 16.05,21.35 16.05,12 21.05,12 21.05,14 22.05,14 22.05,12 24.05,12 24.05,40

### Text on the board
tNames: R1 | R2 | 3V3 | DIO | U1 | GND | CLK | RST | PROG | MINI SAM | MINI | SAM | RESET | BUTTON
bNames: RST | GND | ~15 | 3V3 | ~14 | VIN | ~A6 | ~MOSI | build / 01/17 / 012 | ~A5 | ~SCK | Design: / Benjamin Shockley / @bwshockley | ~A4 | ~SS | ~A3 | ~MISO | ~A2 | ~SDA | ~A1 | ~SCL | A0 | TX | 27 | AREF | RX | 28